# Altium schematic sheet Serial_Expansion.SchDoc: RP2040 CNC
size B; Author: AM; CompanyName: Expatria Technologies; DrawnBy: A.Marles; Engineer: AM; Organization: Expatria Technolgoies; DocumentNumber: 7; SheetNumber: 7; SheetTotal: 14
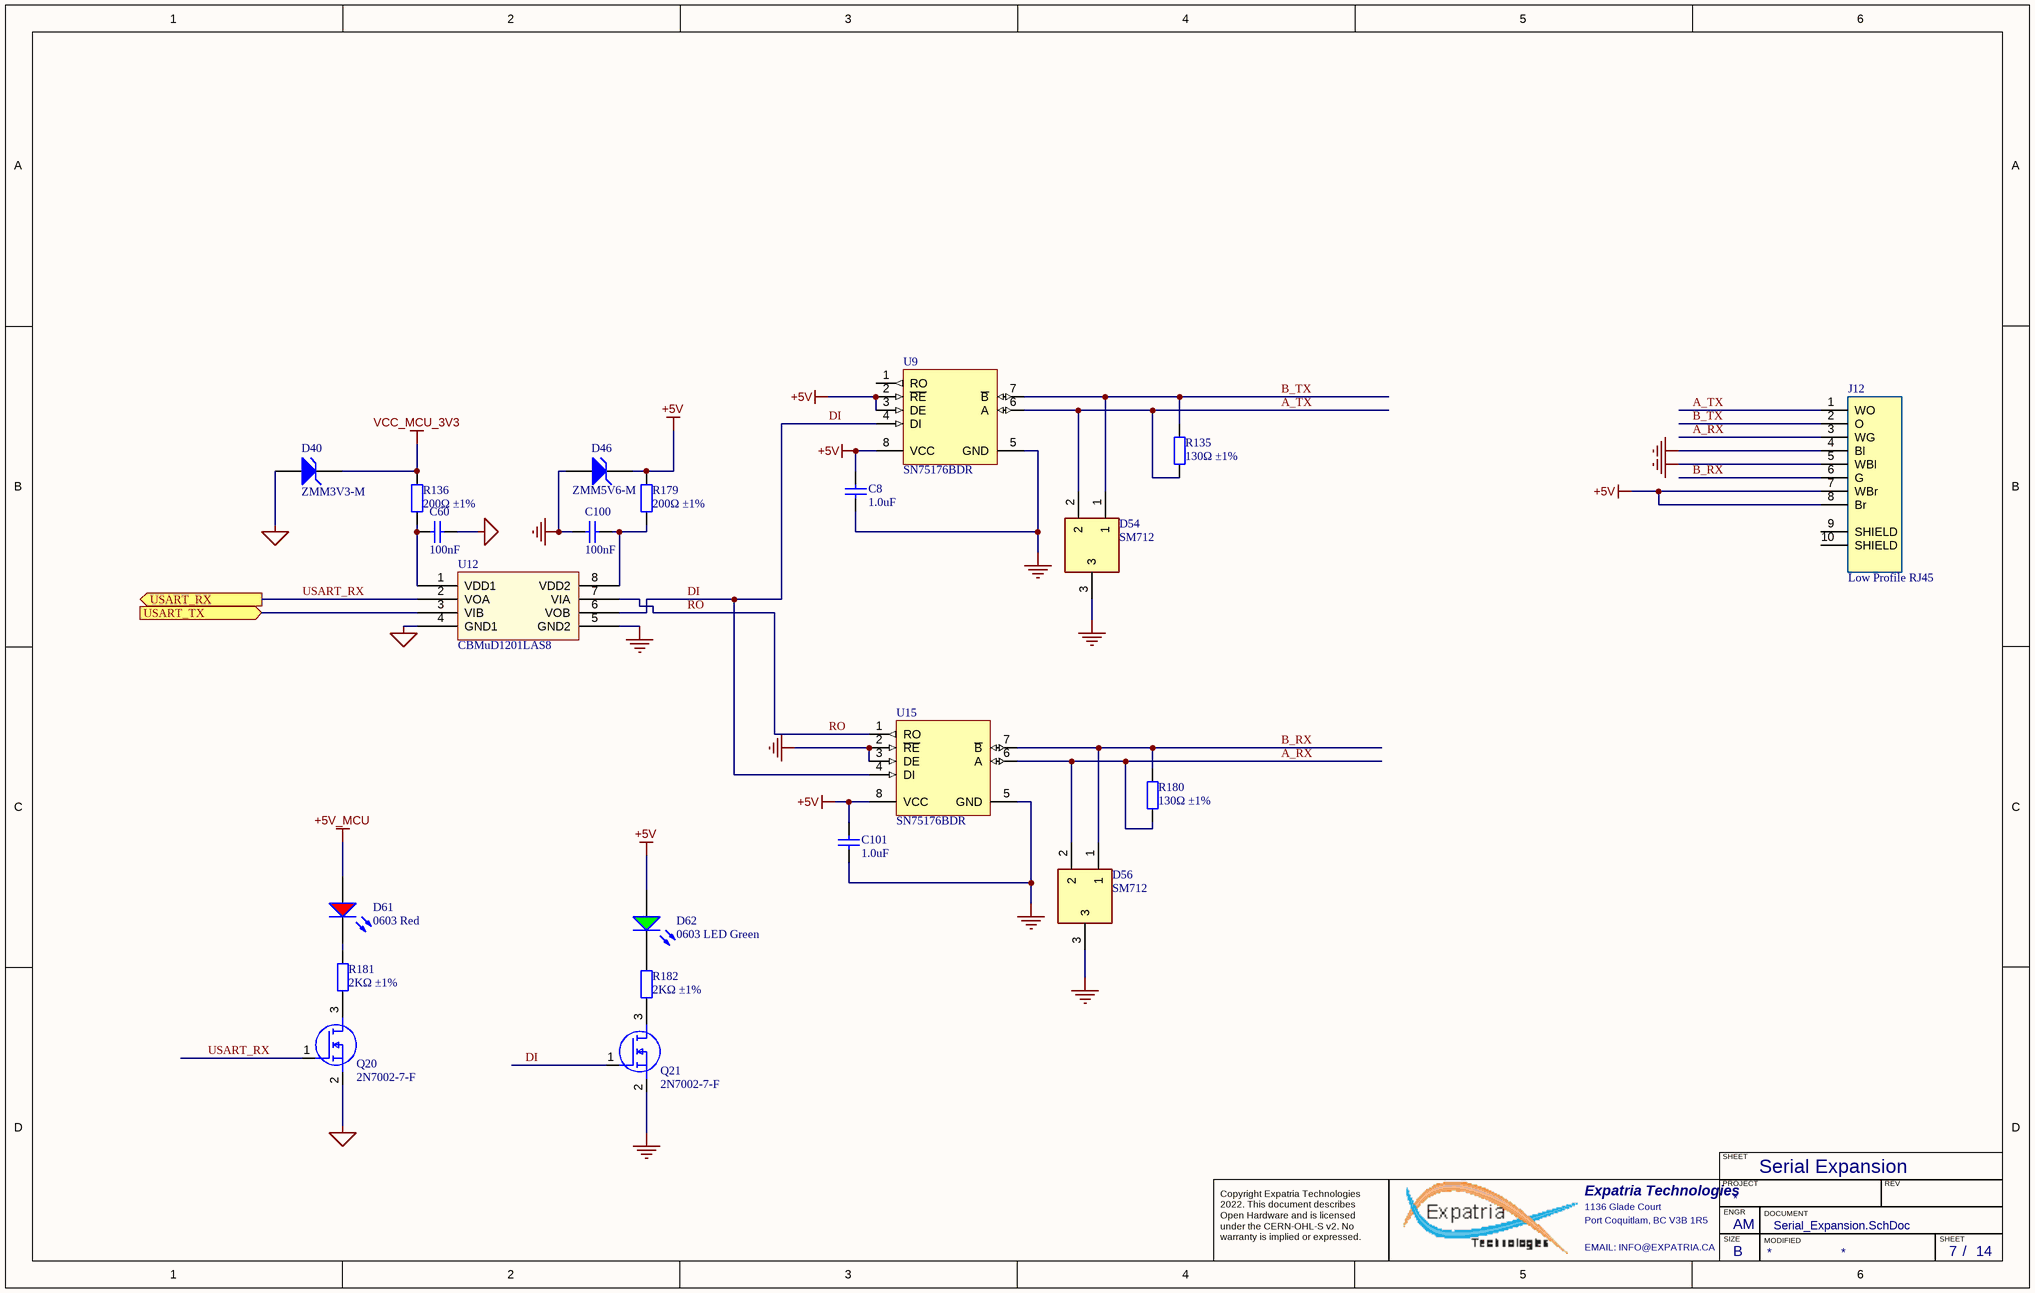
[diagram p0: Serial_Expansion.SchDoc]

## Parts
C8  1.0uF  [0402_C]
C60  100nF  [0402_C]
C100  100nF  [0402_C]
C101  1.0uF  [0402_C]
D40  ZMM3V3-M  [LL-34]
D46  ZMM5V6-M  [LL-34]
D54  SM712  [SOT95P230X117-3N]
D56  SM712  [SOT95P230X117-3N]
D61  0603 Red  [0603_LED_S1]
D62  0603 LED Green  [0603_LED_S1]
J12  Low Profile RJ45  [RJ45-SMD_MJ88-B011-HLSV6-P]
Q20  2N7002-7-F  [SOT-23(SOT-23-3)]
Q21  2N7002-7-F  [SOT-23(SOT-23-3)]
R135  130Ω ±1%  [0603_R]
R136  200Ω ±1%  [0402_R]
R179  200Ω ±1%  [0402_R]
R180  130Ω ±1%  [0603_R]
R181  2KΩ ±1%  [0402_R]
R182  2KΩ ±1%  [0402_R]
U9  SN75176BDR  [SOIC-8_150mil]
U12  CBMuD1201LAS8  [SOIC-8_150mil]
U15  SN75176BDR  [SOIC-8_150mil]

## Ports
USART_RX (out), USART_TX (in)

## Nets
+5V: C8.2 C101.2 D46.2(K) D62.A J12.7(WBr) J12.8(Br) R179.2 U9.2(~{RE}) U9.3(DE) U9.8(VCC) U15.8(VCC)
+5V_MCU: D61.A
GND: C8.1 C100.1 C101.1 D46.1(A) D54.3 D56.3 J12.4(Bl) J12.5(WBl) Q21.2(S) U9.5(GND) U12.5(GND2) U15.2(~{RE}) U15.3(DE) U15.5(GND)
MCU_GND: C60.2 D40.1(A) Q20.2(S) U12.4(GND1)
VCC_MCU_3V3: D40.2(K) R136.2
A_RX: D56.2 J12.3(WG) R180.1 U15.6(A)
A_TX: D54.2 J12.1(WO) R135.1 U9.6(A)
B_RX: D56.1 J12.6(G) R180.2 U15.7(~{B})
B_TX: D54.1 J12.2(O) R135.2 U9.7(~{B})
DI: Q21.1(G) U9.4(DI) U12.6(VOB) U15.4(DI)
RO: U12.7(VIA) U15.1(RO)
USART_RX: Q20.1(G) U12.2(VOA) ; port USART_RX
USART_TX: U12.3(VIB) ; port USART_TX
NetC60_1: C60.1 R136.1 U12.1(VDD1)
NetC100_2: C100.2 R179.1 U12.8(VDD2)
NetD61_K: D61.K R181.2
NetD62_K: D62.K R182.2
NetQ20_3: Q20.3(D) R181.1
NetQ21_3: Q21.3(D) R182.1

Not connected (* = marked no-connect by the designer): J12 9(SHIELD) 10(SHIELD); U9 1(RO)

## Notes on the sheet
- Serial Expansion
- SHEET
- Expatria Technologies
- 1136 Glade Court
- Port Coquitlam, BC V3B 1R5
- PROJECT
- SIZE
- ENGR
- MODIFIED
- DOCUMENT
- REV
- Copyright Expatria Technologies 2022. This document describes Open Hardware and is licensed under the CERN-OHL-S v2. No warranty is implied or expressed.
- EMAIL: INFO@EXPATRIA.CA
- B
- /

## Library data of the parts
C8 C101 = 0402 1.0uF (105) 10% 25V: Chip capacitor; Manufacturer: Samsung Electro-Mechanics; PartNumber: CL05A105KA5NQNC; Capacitance: 1uF; Tolerance: 10%; Voltage: 25V; ComponentLink1Description: Supplier link; ComponentLink1URL: http://www.szlcsc.com/product/details_53938.html; Package: 0402; Supplier: LC; SuppliersPartNumber: C52923
C60 C100 = 0402 100nF (104) 10% 16V: 16V 100nF X7R ±10% 0402 Multilayer Ceramic Capacitors MLCC - SMD/SMT ROHS; Manufacturer: Samsung Electro-Mechanics; Manufacturer Part Number: CL05B104KO5NNNC; ComponentLink1Description: Supplier link; ComponentLink1URL: http://www.szlcsc.com/product/details_1877.html; Package: 0402; Supplier: LC; SuppliersPartNumber: C1525; Capacitance: 100nF; Tolerance: 10%; Voltage: 16V
D40 = LL-34 ZMM3V3-M: Single 3.1V~3.5V 500mW 3.3V LL-34 Zener Diodes ROHS; Manufacturer: ST(Semtech); ComponentLink1Description: 供应商链接; ComponentLink1URL: http://www.szlcsc.com/product/details_8541.html; Package: LL-34; Supplier: LC; SuppliersPartNumber: C8056; Manufacturer Part Number: ZMM3V3-M
D46 = LL-34 ZMM5V6-M: Single 5.2V~6V 500mW 5.6V LL-34 Zener Diodes ROHS; Manufacturer: ST(Semtech); ComponentLink1Description: 供应商链接; ComponentLink1URL: http://www.szlcsc.com/product/details_8541.html; Package: LL-34; Supplier: LC; SuppliersPartNumber: C8062; Manufacturer Part Number: ZMM5V6-M
D54 D56 = CDSOT23-SM712: Bidirectional 12V (Max), 7V (Max) 7.5V / 13.3V 10V / 20V 12A(8/20us) SOT-23-3 TVS RoHS; Manufacturer_Name: DOWO; Height: 1.17mm; Manufacturer_Part_Number: SM712; SuppliersPartNumber: C293966
D61 = 19-213SURC/S530-A3/TR8: 20mA 632nm Colorless transparence 624nm~624nm -40℃~+85℃ Red 120° 60mW 0603 Light Emitting Diodes (LED) ROHS; Manufacturer: Everlight Elec; ComponentLink1Description: 供应商链接; ComponentLink1URL: http://www.szlcsc.com/product/details_2659.html; Package: 0603; Supplier: LC; SuppliersPartNumber: C72039; Color: Red; Supplier 1: LC; Supplier Part Number 1: C72039; Manufacturer Part Number: 19-213SURC/S530-A3/TR8
D62 = 19-217/GHC-YR1S2/3T: Colorless transparence -40℃~+85℃ 520nm~535nm Emerald 120° 110mW 0603 Light Emitting Diodes (LED) ROHS; Manufacturer: Everlight Elec; Package: 0603; Supplier: LC; SuppliersPartNumber: C72043; Color: Green; Manufacturer Part Number: 19-217/GHC-YR1S2/3T
J12 = MJ88-B011-HLSV6-P: Micro USB; MF: Heling; SuppliersPartNumber: C501463; Part+Number: MJ88-B011-HLSV6-P
Q20 Q21 = 2N7002-7-F: 60V 115mA 7.5Ω@5V,50mA 370mW N Channel SOT-23 MOSFETs ROHS; Manufacturer: Diodes Inc.; SuppliersPartNumber: C85049; Manufacturer Part Number: 2N7002-7-F; Value: 2N7002-7-F; Datasheet Link: https://datasheet.datasheetarchive.com/originals/distributors/SFDatasheet-0/sf-0003625.pdf; Height: 1.2mm; Manufacturer_Part_Number: 2N7002-7-F; Mouser Part Number: 621-2N7002-F; Mouser Price/Stock: https://www.mouser.co.uk/ProductDetail/Diodes-Incorporated/2N7002-7-F?qs=jMXWnm70%252BC%252BAX%252BMLzUkTZg%3D%3D; Arrow Part Number: 2N7002-7-F; Arrow Price/Stock: https://www.arrow.com/en/products/2n7002-7-f/diodes-incorporated?region=nac
R135 R180 = 0603 130R (1300) 1%: Chip resistor; Manufacturer: Uniroyal Elec; PartNumber: 0603WAF1300T5E; Power: 1/10W; ComponentLink1Description: Supplier link; ComponentLink1URL: http://www.szlcsc.com/product/details_23523.html; Package: 0603; Supplier: LC; SuppliersPartNumber: C22796; Resistance: 130Ω; Tolerance: 1%
R136 R179 = 0402 200R (2000) 1%: Chip resistor; Manufacturer: Uniroyal Elec; Manufacturer Part Number: 0402WGF2000TCE; Power: 1/16W; ComponentLink1Description: Supplier link; ComponentLink1URL: http://www.szlcsc.com/product/details_25830.html; Package: 0402; Supplier: LC; SuppliersPartNumber: C25087; Resistance: 200Ω; Tolerance: 1%
R181 R182 = 0402 2K (2001) 1%: Chip resistor; Manufacturer: Uniroyal Elec; Manufacturer Part Number: 0402WGF2001TCE; Power: 1/16W; ComponentLink1Description: Supplier link; ComponentLink1URL: http://www.szlcsc.com/product/details_4516.html; Package: 0402; Supplier: LC; SuppliersPartNumber: C4109; Resistance: 2KΩ; Tolerance: 1%
U9 U15 = SN75176BDR_[C7063]: RS-485/RS-422; ComponentLink1Description: 供应商链接; ComponentLink1URL: http://www.szlcsc.com/product/details_7535.html; Package: SOIC-8_150mil; Supplier: LC; SuppliersPartNumber: C7063
U12 = CBMuD1201LAS8: Dual Channel Isolator; Manufacturer: Corebai Microelectronics; Package: SOIC-8_150mil; Supplier: LC; SuppliersPartNumber: C476472; ComponentLink1Description: 供应商链接; ComponentLink1URL: http://www.szlcsc.com/product/details_10199.html; Manufacturer Part Number: CBMuD1201LAS8